# Altium project CurrentProbe.PrjPcb
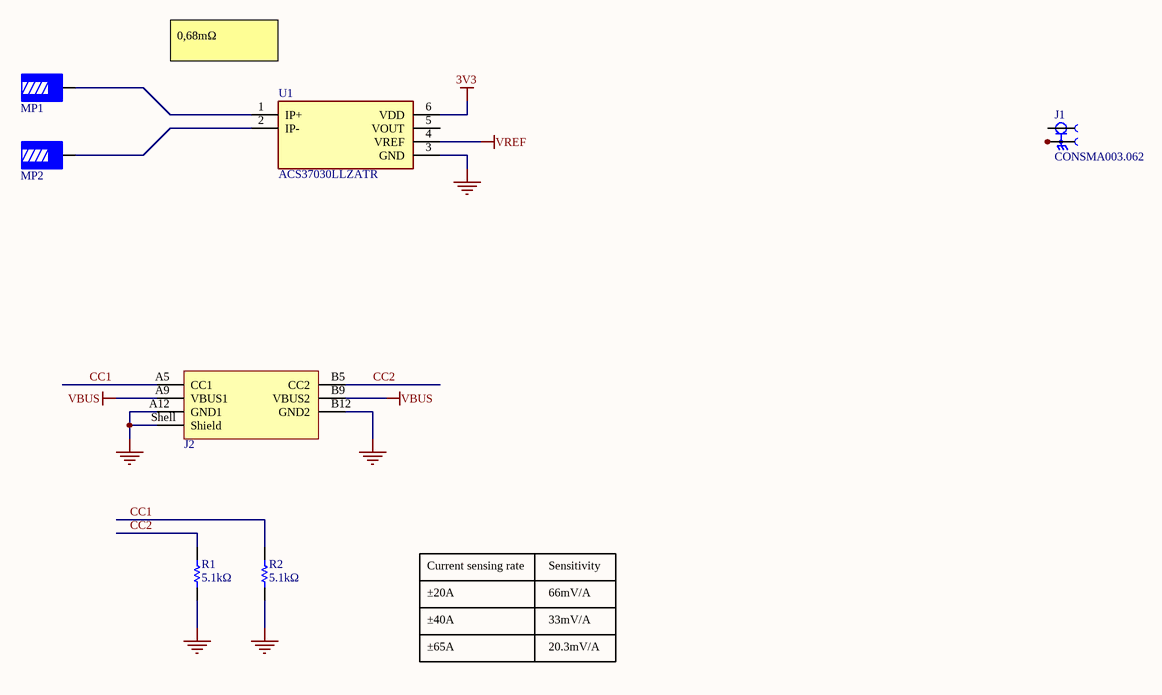
[diagram p0: CurrentProbe.SchDoc]
1 sheet, 7 parts. Net scope: global (net labels, ports and power ports of the same name join across sheets).

## Sheet CurrentProbe.SchDoc
size A4; SheetNumber: 1; SheetTotal: 1

### Parts
J1  CONSMA003.062  [CONSMA003.062]
J2  632722100213  [632722100213]  (value not drawn)
MP1  M3 x 5mm  [7461057_chemical surface]  (value not drawn)
MP2  M3 x 5mm  [7461057_chemical surface]  (value not drawn)
R1  RES  [RES_0603_H050 (_IPC_MD)]  (value not drawn)
R2  RES  [RES_0603_H050 (_IPC_MD)]  (value not drawn)
U1  ACS37030LLZATR  [ACS37030LLZATR020B3]

### Nets
3V3: U1.6(VDD)
GND: J2.A12(GND1) J2.B12(GND2) J2.Shell(Shield) R1.1 R2.1 U1.3(GND)
VBUS: J2.A9(VBUS1) J2.B9(VBUS2)
VREF: U1.4(VREF)
CC1: J2.A5(CC1) R2.2
CC2: J2.B5(CC2) R1.2
NetJ1_S1: J1.S1 J1.S2 J1.S3 J1.S4
NetMP1_1: MP1.1 U1.1(IP+)
NetMP2_1: MP2.1 U1.2(IP-)

Not connected (* = marked no-connect by the designer): J1 1; U1 5(VOUT)

### Notes on the sheet
- 0,68mΩ
- Current sensing rate
- ±20A
- ±40A
- Sensitivity
- 66mV/A
- 33mV/A
- ±65A
- 20.3mV/A

### Library data of the parts
J1 = CONSMA003.062: SMA Connector Receptacle, Female Socket 50Ohm Board Edge, End Launch Solder; MF: Linx Technologies; Designator: J?; Temp: I; SnapEDA_Link: https://www.snapeda.com/parts/CONSMA003.062/Linx%20Technologies%20Inc./view-part/45302/?ref=snap; Check_prices: https://www.snapeda.com/parts/CONSMA003.062/Linx%20Technologies%20Inc./view-part/45302/?ref=eda; Value: *; Availability: In Stock; MP: CONSMA003.062; Price: None; Package: None; Part Number: CONSMA003.062; Component: SMA; Type: Standard; Qty: 1; Supplier 1: Arrow; Supplier 2: Avnet; Supplier 3: Digi-Key; Supplier Part Number 3: CONSMA003.062-ND; Supplier 4: Distrelec; Supplier 5: Farnell; Supplier 6: Future Electronics; Supplier 7: Mouser; Supplier Part Number 7: 712-CONSMA003.062; Supplier 8: RSComponents; Supplier 9: Rutronik; Supplier 10: TTI
J2 = 632722100213: WR-COM USB Power Delivery Type C Receptacle Horizontal SMT; Manufacturer: Wurth Elektronik; Match Code: WR-USB; Number of Ports: 1; Rated Current: 5; Working Voltage: 48V (DC); Manufacturer Part Number: 632722100213; ComponentLink1Description: Website Link; ComponentLink1URL: https://www.we-online.com/redexpert/article/632722100213?ad; ComponentLink2Description: Datasheet Link; ComponentLink2URL: https://www.we-online.com/redexpert/spec/632722100213?ad; Mount: Surface Mount; Operating Temperature Max: 85°C; Operating Temperature Min: -40°C; Packaging: Tape and Reel; Application: USB Power Delivery; Gender: Receptacle; Number of Pins: 6; Orientation: Horizontal; Category: Input/Output Connectors
MP1 MP2 = 7461057: WP-BUTR REDCUBE PRESS-FIT with internal thread, two-rows, L7W7H6mm, M3 x 5mm, 100A; Manufacturer: Wurth Elektronik; Surface: Tin; ComponentLink1Description: Website Link; ComponentLink1URL: https://www.we-online.com/redexpert/article/7461057?ad; ComponentLink2Description: Datasheet Link; ComponentLink2URL: https://www.we-online.com/redexpert/spec/7461057?ad; Manufacturer Part Number: 7461057; Category: REDCUBE PRESS-FIT; Match Code: WP-BUTR; Mount: Press Fit; Operating Temperature Max: 150°C; Operating Temperature Min: -55°C; Packaging: Bulk; Length: 7mm; Width: 7mm; Height: 6mm; Material: Brass; Number of Pins: 6; Rated Current: 100A; Thread Length: 5mm; Thread Size: M3
R1 R2 = GPR06035K1: 5.1kΩ; Values: 5.1; Resistance: kΩ; Tolerance: 1; Power: 100mW; Voltage: 75V; Designator: R; PCB Lib: RES.PcbLib; Scm Lib: Discrete.SchLib; Part Number: GPR06035K1; R: 5.1kΩ; Type: Standard
U1 = ACS37030LLZATR-040B3: Current Sensor 40A 1 Channel Hall Effect Bidirectional 8-SOIC (0.154", 3.90mm Width), 6 Leads; Manufacturer_Name: Allegro Microsystems; Manufacturer_Part_Number: ACS37030LLZATR-020B3; Temp: -40°C ~ 150°C; Datasheet Link: https://www.allegromicro.com/~/media/Files/Datasheets/ACS37030-32-Datasheet; Height: 1.82mm; Mouser Part Number: 250-ACS37030-020B3; Mouser Price/Stock: https://www.mouser.co.uk/ProductDetail/Allegro-MicroSystems/ACS37030LLZATR-020B3?qs=mELouGlnn3emZqEKPqXtdg%3D%3D; Part Number: ACS37030LLZATR-040B3; Component: ACS37030LLZATR-040B3; Type: Standard; Curr: 40A; Qty: 1; Supplier 1: Arrow; Supplier 3: Digi-Key; Supplier Part Number 3: 620-ACS37030LLZATR-040B3CT-ND